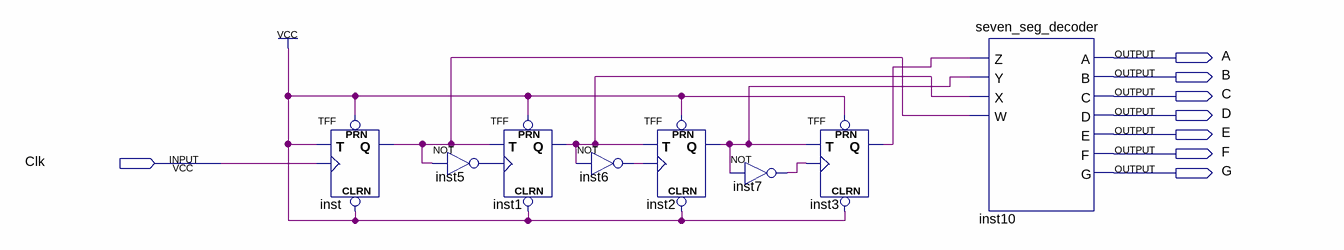
[diagram p0: schematic sheet]
// Quartus schematic lab10step3a.bdf as structural Verilog: 8 symbols, 8 pins
module lab10step3a (
  input  Clk,
  output A,
  output B,
  output C,
  output D,
  output E,
  output F,
  output G
);

  wire inst1_q, inst2_q, inst3_q, inst5_out, inst6_out, inst7_out, inst_q;

  TFF inst (.PRN(1'b1), .CLRN(1'b1), .T(1'b1), .CLK(Clk), .Q(inst_q));
  TFF inst1 (.PRN(1'b1), .CLRN(1'b1), .T(inst_q), .CLK(inst5_out), .Q(inst1_q));
  not inst5 (inst5_out, inst_q);
  TFF inst2 (.PRN(1'b1), .CLRN(1'b1), .T(inst1_q), .CLK(inst6_out), .Q(inst2_q));
  not inst6 (inst6_out, inst1_q);
  not inst7 (inst7_out, inst2_q);
  TFF inst3 (.PRN(1'b1), .CLRN(1'b1), .T(inst2_q), .CLK(inst7_out), .Q(inst3_q));
  seven_seg_decoder inst10 (
    .Z(inst3_q), .Y(inst2_q), .X(inst1_q), .W(inst_q), .A(A), .B(B), .C(C), .D(D), .E(E), .F(F), .G(G));
endmodule
